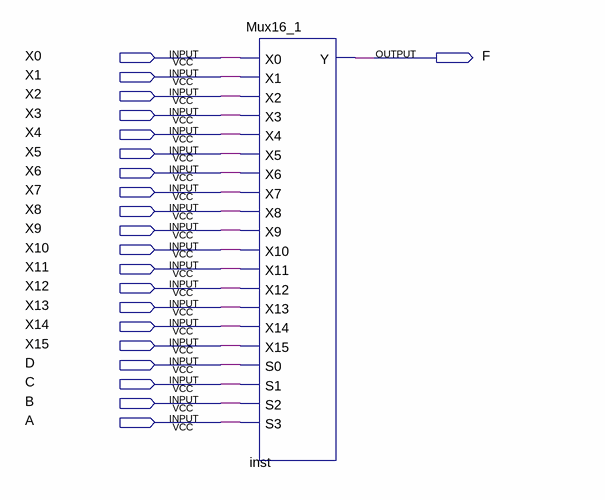
[diagram p0: schematic sheet]
// Quartus schematic MuxDemo3.bdf as structural Verilog: 1 symbols, 21 pins
module MuxDemo3 (
  input  X0,
  input  X1,
  input  X2,
  input  X3,
  input  X4,
  input  X5,
  input  X6,
  input  X7,
  input  X8,
  input  X9,
  input  X10,
  input  X11,
  input  X12,
  input  X13,
  input  X14,
  input  X15,
  input  D,
  input  C,
  input  B,
  input  A,
  output F
);

  Mux16_1 inst (
    .X0(X0), .X1(X1), .X2(X2), .X3(X3), .X4(X4), .X5(X5), .X6(X6), .X7(X7), .X8(X8), .X9(X9), .X10(X10),
    .X11(X11), .X12(X12), .X13(X13), .X14(X14), .X15(X15), .S0(D), .S1(C), .S2(B), .S3(A), .Y(F));
endmodule
